# EAGLE design 3-BitSelect (EAGLE 7.4.0)
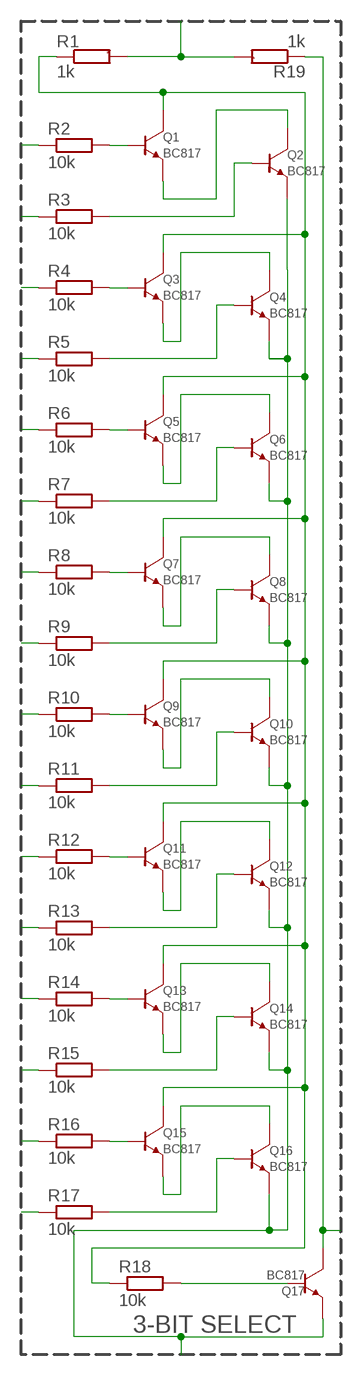
[diagram p0: schematic, sheet 1]

## Parts
Q1  BC817  TRANSISTOR-NPN-GENERICDEFAULT-SOT23-BEC  [SOT23]
Q2  BC817  TRANSISTOR-NPN-GENERICDEFAULT-SOT23-BEC  [SOT23]
Q3  BC817  TRANSISTOR-NPN-GENERICDEFAULT-SOT23-BEC  [SOT23]
Q4  BC817  TRANSISTOR-NPN-GENERICDEFAULT-SOT23-BEC  [SOT23]
Q5  BC817  TRANSISTOR-NPN-GENERICDEFAULT-SOT23-BEC  [SOT23]
Q6  BC817  TRANSISTOR-NPN-GENERICDEFAULT-SOT23-BEC  [SOT23]
Q7  BC817  TRANSISTOR-NPN-GENERICDEFAULT-SOT23-BEC  [SOT23]
Q8  BC817  TRANSISTOR-NPN-GENERICDEFAULT-SOT23-BEC  [SOT23]
Q9  BC817  TRANSISTOR-NPN-GENERICDEFAULT-SOT23-BEC  [SOT23]
Q10  BC817  TRANSISTOR-NPN-GENERICDEFAULT-SOT23-BEC  [SOT23]
Q11  BC817  TRANSISTOR-NPN-GENERICDEFAULT-SOT23-BEC  [SOT23]
Q12  BC817  TRANSISTOR-NPN-GENERICDEFAULT-SOT23-BEC  [SOT23]
Q13  BC817  TRANSISTOR-NPN-GENERICDEFAULT-SOT23-BEC  [SOT23]
Q14  BC817  TRANSISTOR-NPN-GENERICDEFAULT-SOT23-BEC  [SOT23]
Q15  BC817  TRANSISTOR-NPN-GENERICDEFAULT-SOT23-BEC  [SOT23]
Q16  BC817  TRANSISTOR-NPN-GENERICDEFAULT-SOT23-BEC  [SOT23]
Q17  BC817  TRANSISTOR-NPN-GENERICDEFAULT-SOT23-BEC  [SOT23]
R1  1k  R-EU-MARKEDR0603  [R0603-MARK]
R2  10k  R-EU_R0603  [R0603]
R3  10k  R-EU_R0603  [R0603]
R4  10k  R-EU_R0603  [R0603]
R5  10k  R-EU_R0603  [R0603]
R6  10k  R-EU_R0603  [R0603]
R7  10k  R-EU_R0603  [R0603]
R8  10k  R-EU_R0603  [R0603]
R9  10k  R-EU_R0603  [R0603]
R10  10k  R-EU_R0603  [R0603]
R11  10k  R-EU_R0603  [R0603]
R12  10k  R-EU_R0603  [R0603]
R13  10k  R-EU_R0603  [R0603]
R14  10k  R-EU_R0603  [R0603]
R15  10k  R-EU_R0603  [R0603]
R16  10k  R-EU_R0603  [R0603]
R17  10k  R-EU_R0603  [R0603]
R18  10k  R-EU_R0603  [R0603]
R19  1k  R-EU-MARKEDR0603  [R0603-MARK]

## Nets
_VN: Q2.P$2(EMITTER) Q4.P$2(EMITTER) Q6.P$2(EMITTER) Q8.P$2(EMITTER) Q10.P$2(EMITTER) Q12.P$2(EMITTER) Q14.P$2(EMITTER) Q16.P$2(EMITTER) Q17.P$2(EMITTER)
_VP: R1.2 R19.2
I1: R3.1
I2: R5.1
I3: R7.1
I4: R9.1
I5: R11.1
I6: R13.1
I7: R15.1
I8: R17.1
N$27: Q1.P$1(BASE) R2.2
N$28: Q2.P$1(BASE) R3.2
N$29: Q1.P$2(EMITTER) Q2.P$3(COLLECTOR)
N$32: Q3.P$1(BASE) R4.2
N$33: Q4.P$1(BASE) R5.2
N$34: Q3.P$2(EMITTER) Q4.P$3(COLLECTOR)
N$35: Q5.P$1(BASE) R6.2
N$36: Q6.P$1(BASE) R7.2
N$37: Q5.P$2(EMITTER) Q6.P$3(COLLECTOR)
N$38: Q7.P$1(BASE) R8.2
N$39: Q8.P$1(BASE) R9.2
N$40: Q7.P$2(EMITTER) Q8.P$3(COLLECTOR)
N$41: Q9.P$1(BASE) R10.2
N$42: Q10.P$1(BASE) R11.2
N$43: Q9.P$2(EMITTER) Q10.P$3(COLLECTOR)
N$44: Q11.P$1(BASE) R12.2
N$45: Q12.P$1(BASE) R13.2
N$46: Q11.P$2(EMITTER) Q12.P$3(COLLECTOR)
N$47: Q13.P$1(BASE) R14.2
N$48: Q14.P$1(BASE) R15.2
N$49: Q13.P$2(EMITTER) Q14.P$3(COLLECTOR)
N$50: Q15.P$1(BASE) R16.2
N$51: Q16.P$1(BASE) R17.2
N$52: Q15.P$2(EMITTER) Q16.P$3(COLLECTOR)
N$54: Q17.P$1(BASE) R18.2
OUT: Q17.P$3(COLLECTOR) R19.1
S1: R2.1
S2: R4.1
S3: R6.1
S4: R8.1
S5: R10.1
S6: R12.1
S7: R14.1
S8: R16.1
SEL_INT: Q1.P$3(COLLECTOR) Q3.P$3(COLLECTOR) Q5.P$3(COLLECTOR) Q7.P$3(COLLECTOR) Q9.P$3(COLLECTOR) Q11.P$3(COLLECTOR) Q13.P$3(COLLECTOR) Q15.P$3(COLLECTOR) R1.1 R18.1

## Notes on the sheet
- 3-BIT SELECT

## Library data of the parts
Q1-Q17 = p.peter-gator:TRANSISTOR-NPN-GENERIC; SV_SPICE_MODEL: NPN (); SV_SPICE_ORDER: COLLECTOR;BASE;EMITTER; SV_SPICE_PREFIX: Q
R1 R19 = p.peter-rcl:R-EU-MARKED
R2-R18 = p.peter-gator:R-EU_: RESISTOR, European symbol; SV_SPICE_ORDER: 1;2; SV_SPICE_PREFIX: R

## Board
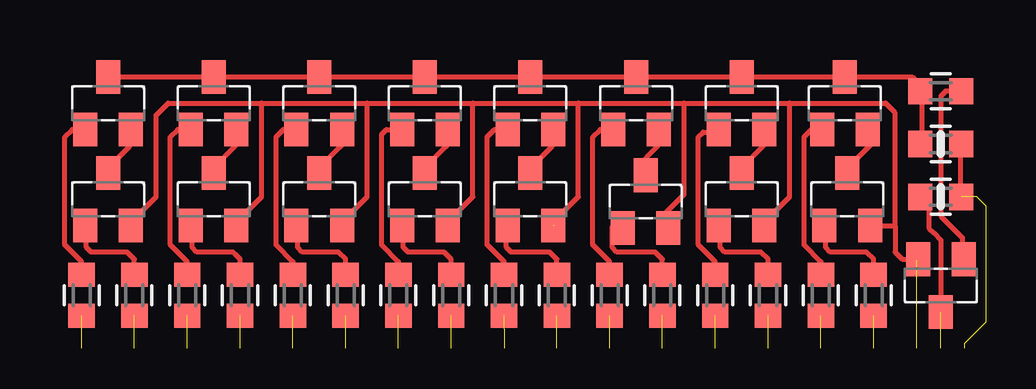
[diagram p1: board, top side]
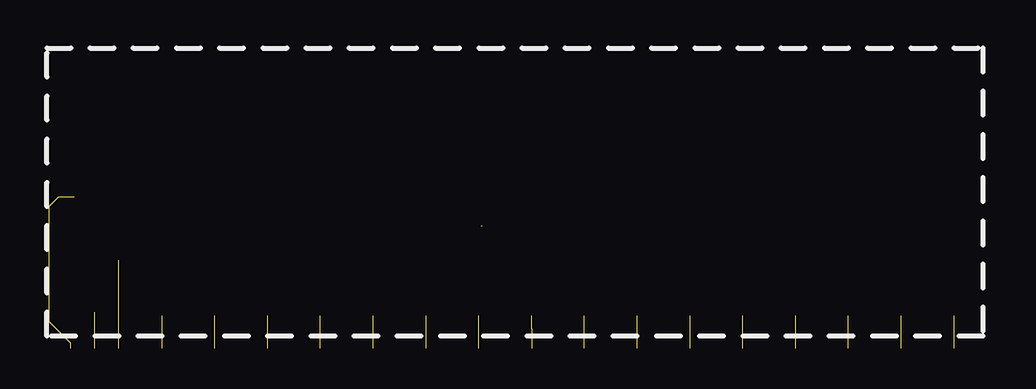
[diagram p2: board, bottom side, seen from below]

No outline drawn. Coordinates in mm, seen from the top.
Copper layers (1*16): Top 0.035mm / dielectric 1.5mm / Bottom 0.035mm
Design rules "Fusion_eagle_rule_v1.1 *": minimum track width 6mil, minimum drill 12mil, track to track 6mil, track to pad 6mil, pad to pad 6mil, via to via 6mil, smd to smd 0mil, copper to edge 10mil, drill to drill 10mil, minimum pad ring 15mil, minimum via ring 6mil, stop-mask expansion 2mil, vias tented up to drill 100mil, thermal gap 10mil

### Footprints (pad centres in the part's own frame; a part is rotated, then mirrored left to right if it is on the bottom)
SOT23 = smd 1 x 1.4: P$1 -0.95,-1.1; P$2 0.95,-1.1; P$3 0,1.1
R0603-MARK = smd 1 x 1.1: 1 -0.85,0; 2 0.85,0
R0603 = smd 1 x 1.1: 1 -0.85,0; 2 0.85,0

### Placement (x,y rotation side)
Q1  2.3,9.7 0 top
Q2  2.3,5.7 0 top
Q3  6.7,9.7 0 top
Q4  6.7,5.7 0 top
Q5  11.1,9.7 0 top
Q6  11.1,5.7 0 top
Q7  15.5,9.7 0 top
Q8  15.5,5.7 0 top
Q9  19.9,9.7 0 top
Q10  19.9,5.7 0 top
Q11  24.3,9.7 0 top
Q12  24.7,5.6 0 top
Q13  28.7,9.7 0 top
Q14  28.7,5.7 0 top
Q15  33,9.7 0 top
Q16  33.1,5.7 0 top
Q17  37,2.1 180 top
R1  37,8 0 top
R2  1.2,1.7 90 top
R3  3.4,1.7 90 top
R4  5.6,1.7 90 top
R5  7.8,1.7 90 top
R6  10,1.7 90 top
R7  12.2,1.7 90 top
R8  14.4,1.7 90 top
R9  16.6,1.7 90 top
R10  18.8,1.7 90 top
R11  21,1.7 90 top
R12  23.2,1.7 90 top
R13  25.4,1.7 90 top
R14  27.6,1.7 90 top
R15  29.8,1.7 90 top
R16  32,1.7 90 top
R17  34.2,1.7 90 top
R18  37,10.2 0 top
R19  37,5.8 0 top

### Tracks (layer width: path | path; a pad name or v marks a point on that pad's centre or on a via)
_VN  (4 unrouted)
  Top 0.2: Q2.P$2 3.25,4.65 3.3,4.7 3.3,4.8 4.3,5.8 4.3,9.2 4.8,9.7 8.7,9.7 | 8.7,9.7 13.1,9.7 | 13.1,9.7 17.5,9.7 | 17.5,9.7 21.9,9.7 | 21.9,9.7 26.3,9.7 | 26.3,9.7 30.7,9.7 | 30.7,9.7 34.7,9.7 35.1,9.3 35.1,4.6 | Q4.P$2 7.65,4.65 7.7,4.7 7.7,4.8 8.7,5.8 8.7,9.7 | Q6.P$2 12.1,4.6 12.1,4.8 13.1,5.8 13.1,9.7 | Q8.P$2 16.5,4.6 16.5,4.8 17.5,5.8 17.5,9.7 | 21,4.6 20.9,4.6 | 20.8,4.6 20.9,4.6 | 20.9,4.6 20.9,4.8 21.9,5.8 21.9,9.7 | Q12.P$2 25.3,4.6 25.3,4.9 26.3,5.9 26.3,9.7 | Q14.P$2 29.7,4.6 29.7,4.8 30.7,5.8 30.7,9.7 | Q16.P$2 35.1,4.6 | 35.1,4.6 35.1,3.5 35.4,3.2 Q17.P$2 36,3.15
_VP  (7 unrouted)
  Top 0.2: R1.2 37.8,8 37.8,5.85 R19.2
I1  (1 unrouted)
I2  (1 unrouted)
I3  (1 unrouted)
I4  (1 unrouted)
I5  (1 unrouted)
I6  (1 unrouted)
I7  (1 unrouted)
I8  (1 unrouted)
N$27
  Top 0.2: R2.2 1.2,3.1 0.9,3.4 0.6,3.7 0.5,3.8 0.5,8.3 0.8,8.6 Q1.P$1
N$28
  Top 0.2: R3.2 3.4,3.2 3.1,3.5 1.6,3.5 1.4,3.7 1.4,4.55 Q2.P$1
N$29
  Top 0.2: Q2.P$3 2.3,7 2.7,7.4 3.2,7.9 3.2,8.55 Q1.P$2
N$32
  Top 0.2: R4.2 5.6,3.1 4.9,3.8 4.9,8.3 5.2,8.6 Q3.P$1
N$33
  Top 0.2: R5.2 7.8,3.2 7.6,3.4 7.5,3.5 6,3.5 5.8,3.7 5.8,4.55 Q4.P$1
N$34
  Top 0.2: Q4.P$3 6.7,7 7.6,7.9 7.6,8.55 Q3.P$2
N$35
  Top 0.2: R6.2 10,3.1 9.3,3.8 9.3,8.3 9.6,8.6 Q5.P$1
N$36
  Top 0.2: R7.2 12.2,3.2 11.9,3.5 10.4,3.5 10.2,3.7 10.2,4.55 Q6.P$1
N$37
  Top 0.2: Q6.P$3 11.1,7 12,7.9 12,8.55 Q5.P$2
N$38
  Top 0.2: R8.2 14.4,3.1 13.7,3.8 13.7,8.4 13.9,8.6 Q7.P$1
N$39
  Top 0.2: R9.2 16.6,3.2 16.3,3.5 14.8,3.5 14.6,3.7 14.6,4.55 Q8.P$1
N$40
  Top 0.2: Q8.P$3 15.5,7 16.4,7.9 16.4,8.55 Q7.P$2
N$41
  Top 0.2: R10.2 18.8,3.1 18.1,3.8 18.1,8.3 18.4,8.6 Q9.P$1
N$42
  Top 0.2: R11.2 21,3.2 20.7,3.5 19.1,3.5 18.9,3.7 18.9,4.55 Q10.P$1
N$43
  Top 0.2: Q10.P$3 19.9,7 20.8,7.9 20.8,8.55 Q9.P$2
N$44
  Top 0.2: R12.2 23.2,3.1 22.5,3.8 22.5,8.3 22.8,8.6 Q11.P$1
N$45
  Top 0.2: R13.2 25.4,3.2 25.1,3.5 23.5,3.5 23.3,3.7 23.3,4.55 Q12.P$1
N$46
  Top 0.2: Q12.P$3 24.3,7 25.2,7.9 25.2,8.55 Q11.P$2
N$47
  Top 0.2: R14.2 27.6,3.1 26.9,3.8 26.9,8.3 27.1,8.5 27.65,8.5 Q13.P$1
N$48
  Top 0.2: R15.2 29.8,3.2 29.5,3.5 28,3.5 27.8,3.7 27.8,4.55 Q14.P$1
N$49
  Top 0.2: Q14.P$3 28.7,7 29.6,7.9 29.6,8.55 Q13.P$2
N$50
  Top 0.2: R16.2 32,3.1 31.3,3.8 31.3,8.3 31.6,8.6 Q15.P$1
N$51
  Top 0.2: R17.2 34.2,3.2 33.9,3.5 32.4,3.5 32.2,3.7 32.2,4.55 Q16.P$1
N$52
  Top 0.2: Q16.P$3 33.1,7 34.1,8 34.1,8.55 Q15.P$2
N$54
  Top 0.2: R18.2 37.9,10.2 37.2,10.2 37,10 37,5.2 37,5 37.9,4.1 37.9,3.25 Q17.P$1
OUT  (3 unrouted)
  Top 0.2: R19.1 36.3,5.8 36.5,5.8 36.5,4.5 36.7,4.3 37,4 Q17.P$3
S1  (1 unrouted)
S2  (1 unrouted)
S3  (1 unrouted)
S4  (1 unrouted)
S5  (2 unrouted)
S6  (1 unrouted)
S7  (1 unrouted)
S8  (1 unrouted)
SEL_INT
  Top 0.2: Q1.P$3 Q3.P$3 Q5.P$3 Q7.P$3 Q9.P$3 Q11.P$3 Q13.P$3 Q15.P$3 33.3,10.8 35.8,10.8 36.2,10.4 36.2,10.25 R18.1 36.2,10.2 36.2,8.05 R1.1